# Altium schematic sheet Input_chanel.SchDoc
size A4
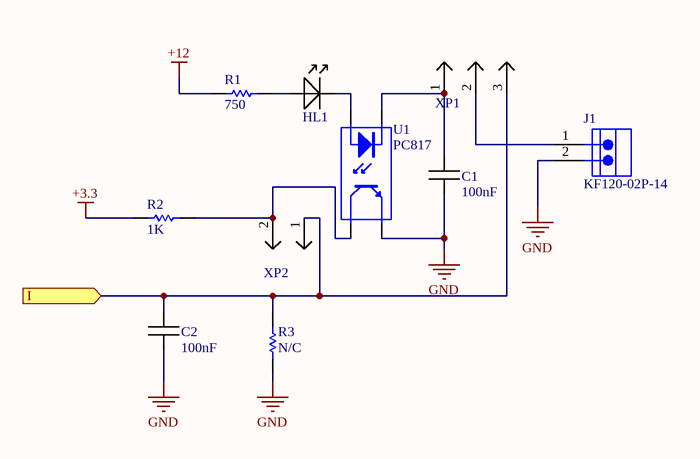
[diagram p0: Input_chanel.SchDoc]

## Parts
C1  Val: 100nF  [CAP0805]  (hidden comment: CAP_SMD)
C2  Val: 100nF  [CAP0805]  (hidden comment: CAP_SMD)
HL1  LED_SMD  [0805_LED]  (value not drawn)
J1  KF120-02P-14  [KF350-3.5-02P]
R1  Val: 750  [RES0805]  (hidden comment: RES_SMD)
R2  Val: 1K  [RES0805]  (hidden comment: RES_SMD)
R3  Val: N/C  [RES0805]  (hidden comment: RES_SMD)
U1  PC817  [DIP-4 - SMT]
XP1  PLS-03  [PLS-03]  (value not drawn)
XP2  PLS-02  [PLS-02]  (value not drawn)

## Ports
I (in)

## Nets
+3.3: R2.1
+12: R1.1
GND: C1.1 C2.1 J1.2 R3.1 U1.3(E)
I: C2.2 R3.2 XP1.3 XP2.1 ; port I
NetC1_2: C1.2 U1.2(K) XP1.1
NetHL1_1: HL1.1(anode) R1.2
NetHL1_2: HL1.2(cathode) U1.1(A)
NetJ1_1: J1.1 XP1.2
NetR2_2: R2.2 U1.4(C) XP2.2

## Library data of the parts
C1 C2 = CAP_SMD: Ceramic capacitor, 0805
HL1 = LED_SMD: 0805 led
J1 = Terminal_2: Euro Terminal Block, 6 A, 150 V, -40 to 105 degC, Pitch 2.54 mm, 1x2 Position, Height 8.6 mm, Tail Length 3.3 mm; Manufacturer: Cixi KaiFeng; Rated Current: 6 A; Contact: Brass; Insulation Resistance: 5000 MOhm / 1000 V; Rated Voltage: 150 V; No. of Pole: 2; Withstanding Voltage: AC 1500 V / 1 Min; Contact Resistance: 20 mOhm; Pitch: Single Pitch; PackageReference: KF120-2; Color: Green; Mounting Technology: Through Hole; PartNumber: KF120-02P-14; PackageDescription: Terminal Block, Pitch 2.54 mm, 1 x 2 Position, Height 8.6 mm, Tail Length 3.3 mm; ComponentLink2Description: Datasheet; ComponentLink1Description: Manufacturer URL; ComponentLink2URL: http://www.nb-kaifeng.com/upload/editor/ext_pdf/201305290533202245.pdf; Temp. Range: -40 to 105 degC; ComponentLink1URL: http://www.nb-kaifeng.com/
U1 = PC817: 4-Pin Phototransistor Optocoupler; Published: 24-Mar-1999; LatestRevisionDate: 04-Mar-2005; LatestRevisionNote: Sch pins 3 & 4 Swapped.; DatasheetVersion: Nov-2003; PackageReference: DIP-4; Publisher: Altium Limited